# Altium schematic sheet Termination5V.SchDoc
size A4; CompanyName: Technische Hochschule Nürnberg Georg Simon Ohm; Address1: Fürther Straße 250; Address2: 90429 Nürnberg; Address3: GERMANY; SheetNumber: 14; SheetTotal: 21; CompanyName2: Institut ELSYS
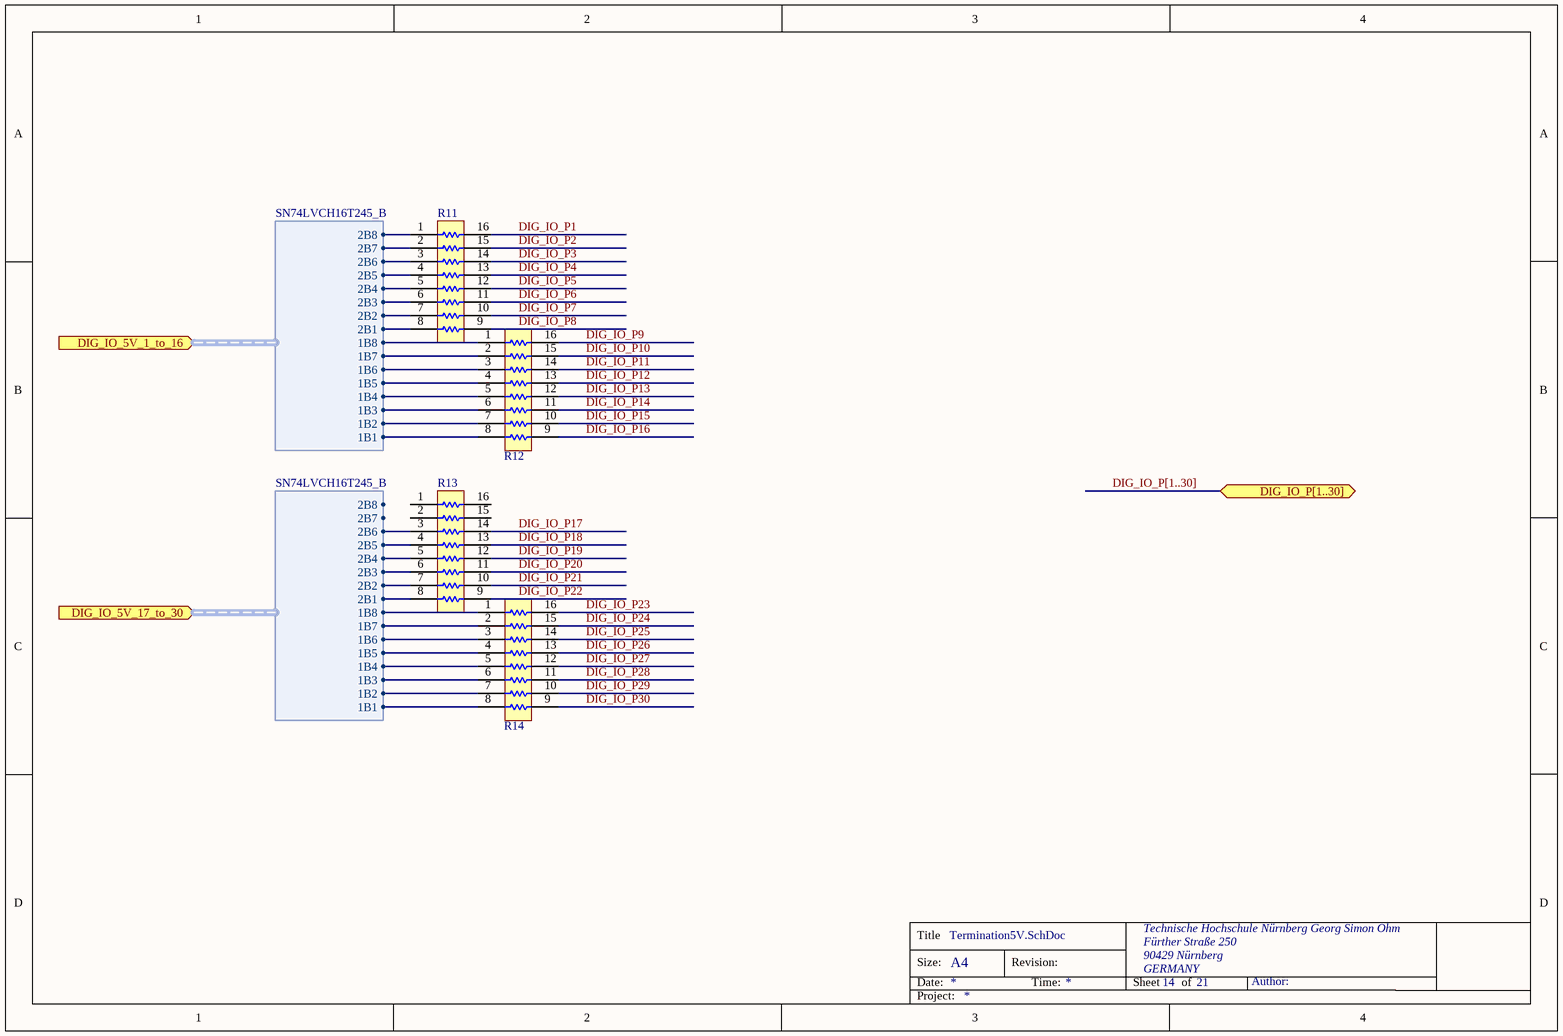
[diagram p0: Termination5V.SchDoc]

## Parts
R11  0.063W  [RESCAXE-50P380X160X45-16N]  (value not drawn)
R12  0.063W  [RESCAXE-50P380X160X45-16N]  (value not drawn)
R13  0.063W  [RESCAXE-50P380X160X45-16N]  (value not drawn)
R14  0.063W  [RESCAXE-50P380X160X45-16N]  (value not drawn)

## Ports
DIG_IO_5V_1_to_16 (in, harness SN74LVCH16T245_B), DIG_IO_5V_17_to_30 (in, harness SN74LVCH16T245_B), DIG_IO_P[1..30] (bidir)

## Harnesses
SN74LVCH16T245_B: 1B1, 1B2, 1B3, 1B4, 1B5, 1B6, 1B7, 1B8, 2B1, 2B2, 2B3, 2B4, 2B5, 2B6, 2B7, 2B8

## Nets
DIG_IO_P1: R11.16
DIG_IO_P2: R11.15
DIG_IO_P3: R11.14
DIG_IO_P4: R11.13
DIG_IO_P5: R11.12
DIG_IO_P6: R11.11
DIG_IO_P7: R11.10
DIG_IO_P8: R11.9
DIG_IO_P9: R12.16
DIG_IO_P10: R12.15
DIG_IO_P11: R12.14
DIG_IO_P12: R12.13
DIG_IO_P13: R12.12
DIG_IO_P14: R12.11
DIG_IO_P15: R12.10
DIG_IO_P16: R12.9
DIG_IO_P17: R13.14
DIG_IO_P18: R13.13
DIG_IO_P19: R13.12
DIG_IO_P20: R13.11
DIG_IO_P21: R13.10
DIG_IO_P22: R13.9
DIG_IO_P23: R14.16
DIG_IO_P24: R14.15
DIG_IO_P25: R14.14
DIG_IO_P26: R14.13
DIG_IO_P27: R14.12
DIG_IO_P28: R14.11
DIG_IO_P29: R14.10
DIG_IO_P30: R14.9
NetR11_1: R11.1 ; port DIG_IO_5V_1_to_16.2B8
NetR11_2: R11.2 ; port DIG_IO_5V_1_to_16.2B7
NetR11_3: R11.3 ; port DIG_IO_5V_1_to_16.2B6
NetR11_4: R11.4 ; port DIG_IO_5V_1_to_16.2B5
NetR11_5: R11.5 ; port DIG_IO_5V_1_to_16.2B4
NetR11_6: R11.6 ; port DIG_IO_5V_1_to_16.2B3
NetR11_7: R11.7 ; port DIG_IO_5V_1_to_16.2B2
NetR11_8: R11.8 ; port DIG_IO_5V_1_to_16.2B1
NetR12_1: R12.1 ; port DIG_IO_5V_1_to_16.1B8
NetR12_2: R12.2 ; port DIG_IO_5V_1_to_16.1B7
NetR12_3: R12.3 ; port DIG_IO_5V_1_to_16.1B6
NetR12_4: R12.4 ; port DIG_IO_5V_1_to_16.1B5
NetR12_5: R12.5 ; port DIG_IO_5V_1_to_16.1B4
NetR12_6: R12.6 ; port DIG_IO_5V_1_to_16.1B3
NetR12_7: R12.7 ; port DIG_IO_5V_1_to_16.1B2
NetR12_8: R12.8 ; port DIG_IO_5V_1_to_16.1B1
NetR13_3: R13.3 ; port DIG_IO_5V_17_to_30.2B6
NetR13_4: R13.4 ; port DIG_IO_5V_17_to_30.2B5
NetR13_5: R13.5 ; port DIG_IO_5V_17_to_30.2B4
NetR13_6: R13.6 ; port DIG_IO_5V_17_to_30.2B3
NetR13_7: R13.7 ; port DIG_IO_5V_17_to_30.2B2
NetR13_8: R13.8 ; port DIG_IO_5V_17_to_30.2B1
NetR14_1: R14.1 ; port DIG_IO_5V_17_to_30.1B8
NetR14_2: R14.2 ; port DIG_IO_5V_17_to_30.1B7
NetR14_3: R14.3 ; port DIG_IO_5V_17_to_30.1B6
NetR14_4: R14.4 ; port DIG_IO_5V_17_to_30.1B5
NetR14_5: R14.5 ; port DIG_IO_5V_17_to_30.1B4
NetR14_6: R14.6 ; port DIG_IO_5V_17_to_30.1B3
NetR14_7: R14.7 ; port DIG_IO_5V_17_to_30.1B2
NetR14_8: R14.8 ; port DIG_IO_5V_17_to_30.1B1

Not connected (* = marked no-connect by the designer): R13 1 2 15 16

## Buses and harness runs
bus DIG_IO_P[1..30] = port DIG_IO_P[1..30]

## Notes on the sheet
- Title
- Size:
- Date:
- A4
- Revision:
- Time:
- Sheet
- of
- Author:
- Project:

## Library data of the parts
R11-R14 = 8xR-Array_1_part: Standard thick film resistor array with 8 resistors; Manufacturer1: Panasonic; MPN1: EXB2HV<2dig_res+#zeros><tol/jumper>V; Parameter1: V; Parameter1Desc: Package Method; Parameter2: J; Parameter2Desc: Tolerance Symbol; MaxVoltage: 100; Created: 2020-01-03_Thilo_Wendt; Supplier1: https://de.farnell.com/w/search?range=inc-in-stock&st=exb2hv; Package: RESCAXE-50P380X160X45-16N; HelpURL: https://www.mouser.de/datasheet/2/315/AOC0000C14-1108062.pdf; Parameter3: *; Parameter3Desc: *; ComponentLink1Description: Datasheet; ComponentLink1URL: https://www.mouser.de/datasheet/2/315/AOC0000C14-1108062.pdf; ComponentLink2Description: Landpattern; ComponentLink2URL: https://industrial.panasonic.com/cdbs/www-data/pdf/AOC0000/AOC0000COL4.pdf